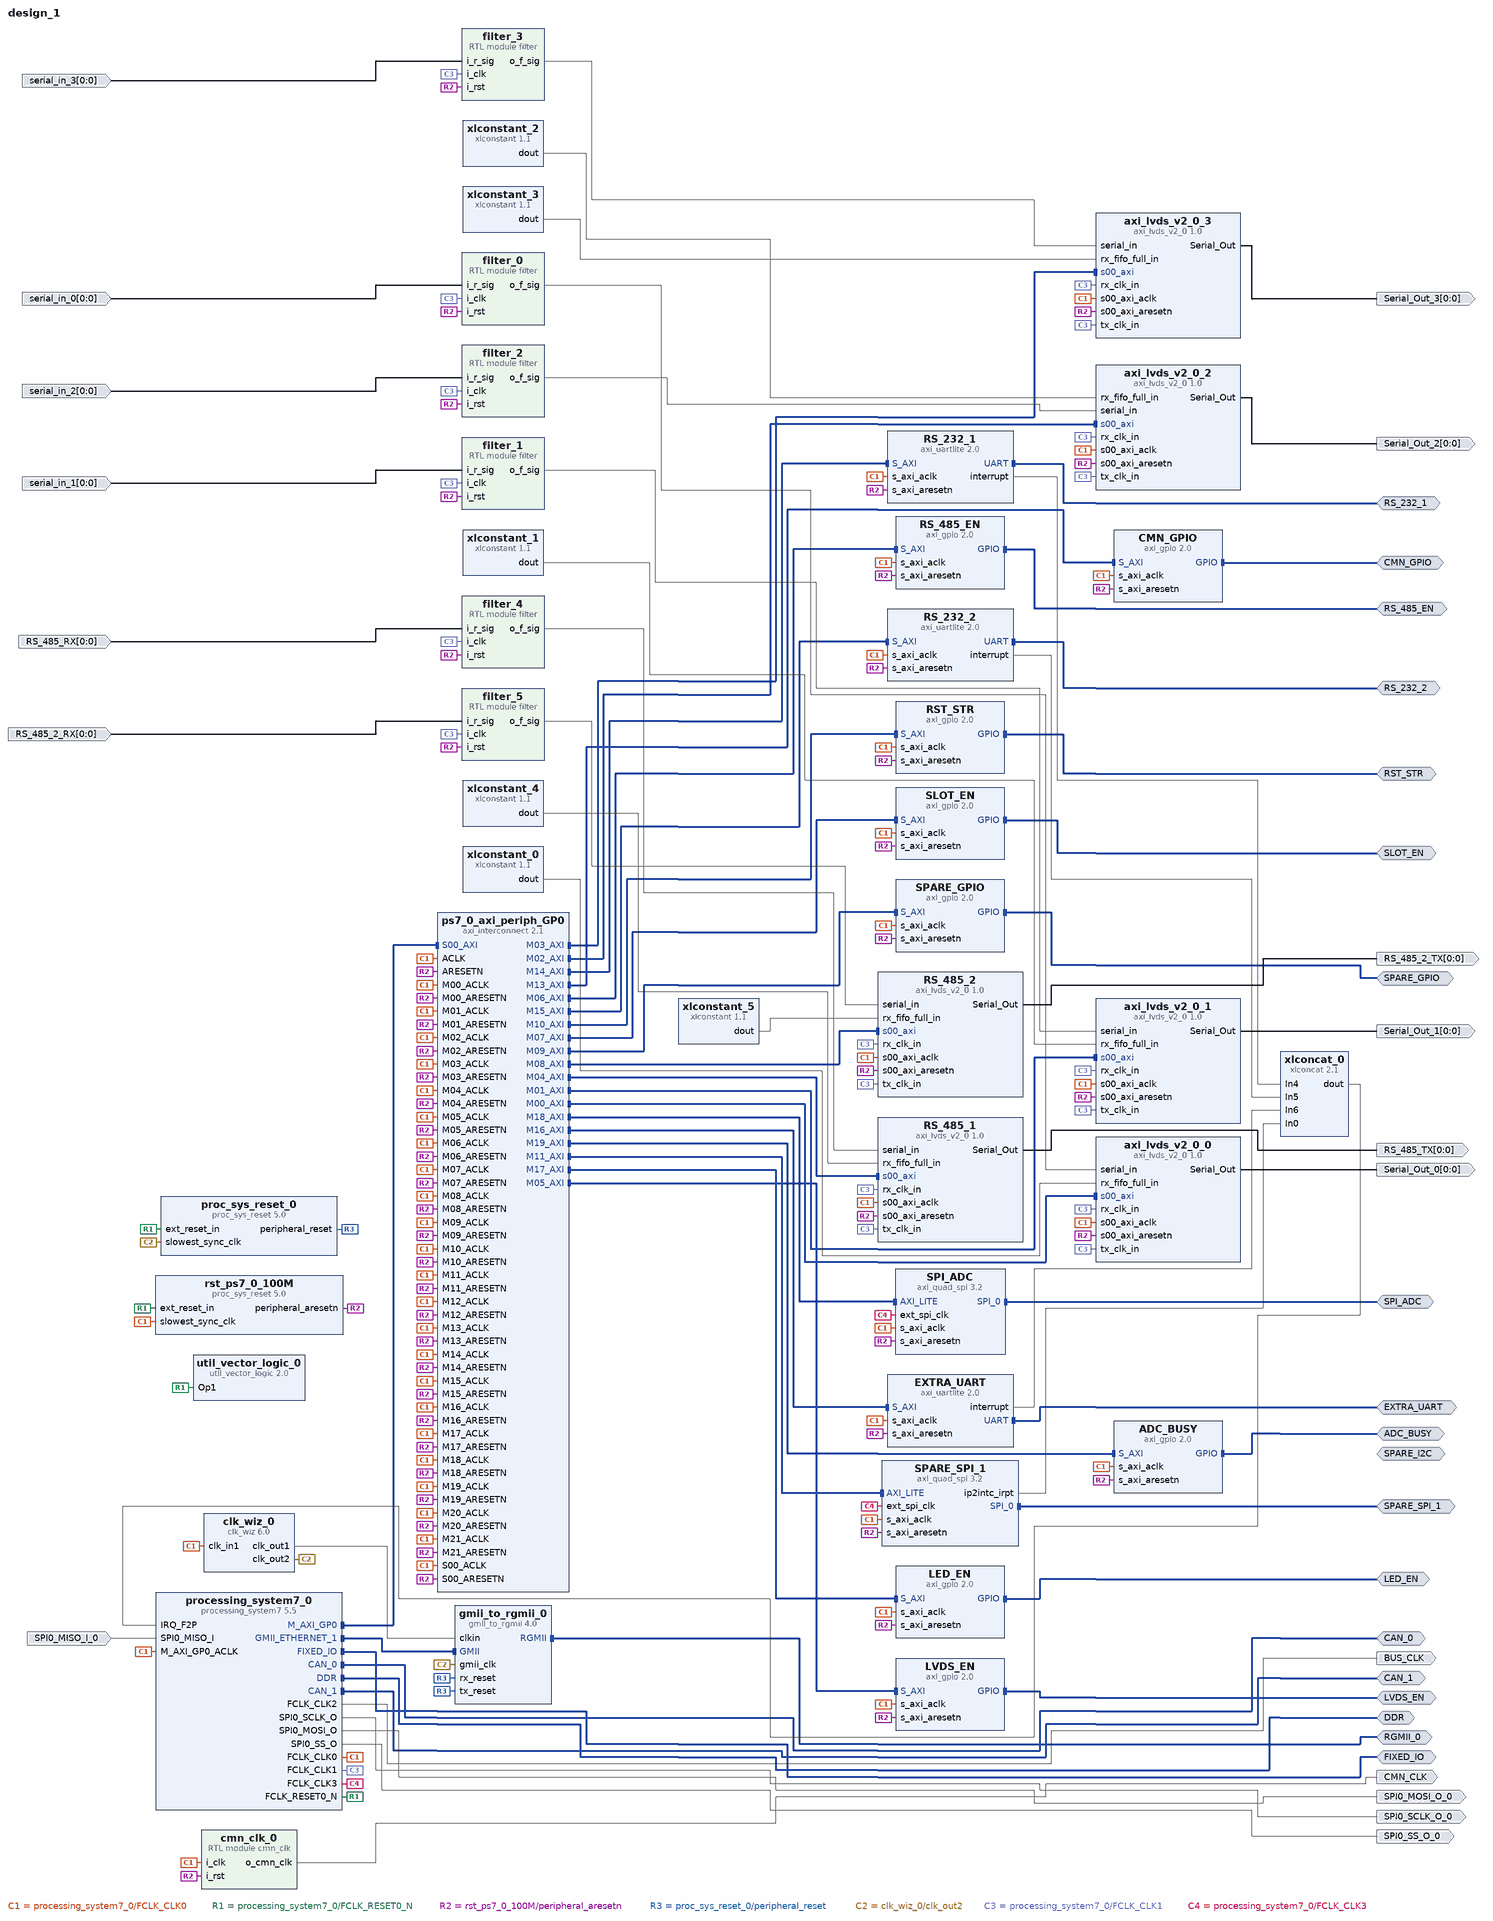
[diagram p0: block diagram of the top level]
# Vivado block design design_1, xc7z020clg400-2, Vivado 2019.1
create_bd_design design_1

create_bd_intf_port -mode Master -vlnv xilinx.com:interface:ddrx_rtl:1.0 DDR
create_bd_intf_port -mode Master -vlnv xilinx.com:display_processing_system7:fixedio_rtl:1.0 FIXED_IO
create_bd_intf_port -mode Master -vlnv xilinx.com:interface:gpio_rtl:1.0 LVDS_EN
create_bd_intf_port -mode Master -vlnv xilinx.com:interface:gpio_rtl:1.0 RS_485_EN
create_bd_intf_port -mode Master -vlnv xilinx.com:interface:rgmii_rtl:1.0 RGMII_0
create_bd_intf_port -mode Master -vlnv xilinx.com:interface:gpio_rtl:1.0 SLOT_EN
create_bd_intf_port -mode Master -vlnv xilinx.com:interface:gpio_rtl:1.0 SPARE_GPIO
create_bd_intf_port -mode Master -vlnv xilinx.com:interface:gpio_rtl:1.0 RST_STR
create_bd_intf_port -mode Master -vlnv xilinx.com:interface:gpio_rtl:1.0 CMN_GPIO
create_bd_intf_port -mode Master -vlnv xilinx.com:interface:uart_rtl:1.0 RS_232_1
create_bd_intf_port -mode Master -vlnv xilinx.com:interface:uart_rtl:1.0 RS_232_2
create_bd_intf_port -mode Master -vlnv xilinx.com:interface:uart_rtl:1.0 EXTRA_UART
create_bd_intf_port -mode Master -vlnv xilinx.com:interface:gpio_rtl:1.0 LED_EN
create_bd_intf_port -mode Master -vlnv xilinx.com:interface:spi_rtl:1.0 SPI_ADC
create_bd_intf_port -mode Master -vlnv xilinx.com:interface:gpio_rtl:1.0 ADC_BUSY
create_bd_intf_port -mode Master -vlnv xilinx.com:interface:spi_rtl:1.0 SPARE_SPI_1
create_bd_intf_port -mode Master -vlnv xilinx.com:interface:can_rtl:1.0 CAN_0
create_bd_intf_port -mode Master -vlnv xilinx.com:interface:can_rtl:1.0 CAN_1
create_bd_intf_port -mode Master -vlnv xilinx.com:interface:iic_rtl:1.0 SPARE_I2C
create_bd_port -dir O -from 0 -to 0 Serial_Out_0
create_bd_port -dir O -from 0 -to 0 Serial_Out_1
create_bd_port -dir I -from 0 -to 0 serial_in_1
create_bd_port -dir O -from 0 -to 0 Serial_Out_2
create_bd_port -dir I -from 0 -to 0 serial_in_2
create_bd_port -dir O -from 0 -to 0 Serial_Out_3
create_bd_port -dir I -from 0 -to 0 serial_in_3
create_bd_port -dir I -from 0 -to 0 serial_in_0
create_bd_port -dir O -type clk BUS_CLK
create_bd_port -dir O -type clk CMN_CLK
create_bd_port -dir I -from 0 -to 0 RS_485_RX
create_bd_port -dir O -from 0 -to 0 RS_485_TX
create_bd_port -dir O -from 0 -to 0 RS_485_2_TX
create_bd_port -dir I -from 0 -to 0 RS_485_2_RX
create_bd_port -dir O SPI0_SCLK_O_0
create_bd_port -dir O SPI0_MOSI_O_0
create_bd_port -dir I SPI0_MISO_I_0
create_bd_port -dir O SPI0_SS_O_0

create_bd_cell -type ip -vlnv xilinx.com:ip:axi_gpio:2.0 LVDS_EN
set_property -dict [list \
  CONFIG.C_ALL_INPUTS 0 \
  CONFIG.C_ALL_OUTPUTS 1 \
  CONFIG.C_DOUT_DEFAULT 0xFFFFFFFF \
  CONFIG.C_GPIO_WIDTH 9 \
  CONFIG.GPIO_BOARD_INTERFACE Custom \
  CONFIG.USE_BOARD_FLOW true \
] [get_bd_cells LVDS_EN]
create_bd_cell -type ip -vlnv xilinx.com:ip:axi_gpio:2.0 RS_485_EN
set_property -dict [list \
  CONFIG.C_ALL_INPUTS 0 \
  CONFIG.C_ALL_OUTPUTS 1 \
  CONFIG.C_GPIO_WIDTH 2 \
  CONFIG.GPIO_BOARD_INTERFACE Custom \
  CONFIG.USE_BOARD_FLOW true \
] [get_bd_cells RS_485_EN]
create_bd_cell -type ip -vlnv xilinx.com:ip:clk_wiz:6.0 clk_wiz_0
set_property -dict [list \
  CONFIG.CLKOUT1_JITTER 114.829 \
  CONFIG.CLKOUT1_REQUESTED_OUT_FREQ 200 \
  CONFIG.CLKOUT2_JITTER 175.402 \
  CONFIG.CLKOUT2_PHASE_ERROR 98.575 \
  CONFIG.CLKOUT2_REQUESTED_OUT_FREQ 25 \
  CONFIG.CLKOUT2_USED true \
  CONFIG.MMCM_CLKOUT0_DIVIDE_F 5.000 \
  CONFIG.MMCM_CLKOUT1_DIVIDE 40 \
  CONFIG.NUM_OUT_CLKS 2 \
  CONFIG.USE_LOCKED false \
  CONFIG.USE_RESET false \
] [get_bd_cells clk_wiz_0]
create_bd_cell -type ip -vlnv xilinx.com:ip:gmii_to_rgmii:4.0 gmii_to_rgmii_0
set_property -dict {CONFIG.C_EXTERNAL_CLOCK true CONFIG.SupportLevel Include_Shared_Logic_in_Core} [get_bd_cells gmii_to_rgmii_0]
create_bd_cell -type ip -vlnv xilinx.com:ip:processing_system7:5.5 processing_system7_0
set_property -dict [list \
  CONFIG.PCW_APU_PERIPHERAL_FREQMHZ 667 \
  CONFIG.PCW_CAN0_CAN0_IO EMIO \
  CONFIG.PCW_CAN0_PERIPHERAL_ENABLE 1 \
  CONFIG.PCW_CAN1_CAN1_IO EMIO \
  CONFIG.PCW_CAN1_PERIPHERAL_ENABLE 1 \
  CONFIG.PCW_CPU_CPU_6X4X_MAX_RANGE 767 \
  CONFIG.PCW_ENET0_ENET0_IO {MIO 16 .. 27} \
  CONFIG.PCW_ENET0_GRP_MDIO_ENABLE 1 \
  CONFIG.PCW_ENET0_GRP_MDIO_IO {MIO 52 .. 53} \
  CONFIG.PCW_ENET0_PERIPHERAL_ENABLE 1 \
  CONFIG.PCW_ENET0_RESET_ENABLE 0 \
  CONFIG.PCW_ENET1_ENET1_IO EMIO \
  CONFIG.PCW_ENET1_PERIPHERAL_ENABLE 1 \
  CONFIG.PCW_ENET_RESET_ENABLE 1 \
  CONFIG.PCW_ENET_RESET_SELECT {Share reset pin} \
  CONFIG.PCW_EN_CLK1_PORT 1 \
  CONFIG.PCW_EN_CLK2_PORT 1 \
  CONFIG.PCW_EN_CLK3_PORT 1 \
  CONFIG.PCW_FCLK_CLK1_BUF TRUE \
  CONFIG.PCW_FCLK_CLK2_BUF TRUE \
  CONFIG.PCW_FCLK_CLK3_BUF TRUE \
  CONFIG.PCW_FPGA0_PERIPHERAL_FREQMHZ 100 \
  CONFIG.PCW_FPGA1_PERIPHERAL_FREQMHZ 200 \
  CONFIG.PCW_FPGA2_PERIPHERAL_FREQMHZ 5 \
  CONFIG.PCW_FPGA3_PERIPHERAL_FREQMHZ 20 \
  CONFIG.PCW_FPGA_FCLK1_ENABLE 1 \
  CONFIG.PCW_FPGA_FCLK2_ENABLE 1 \
  CONFIG.PCW_FPGA_FCLK3_ENABLE 1 \
  CONFIG.PCW_GPIO_MIO_GPIO_ENABLE 1 \
  CONFIG.PCW_GPIO_MIO_GPIO_IO MIO \
  CONFIG.PCW_I2C0_GRP_INT_ENABLE 1 \
  CONFIG.PCW_I2C0_GRP_INT_IO EMIO \
  CONFIG.PCW_I2C0_I2C0_IO {MIO 50 .. 51} \
  CONFIG.PCW_I2C0_PERIPHERAL_ENABLE 1 \
  CONFIG.PCW_I2C1_I2C1_IO {MIO 48 .. 49} \
  CONFIG.PCW_I2C1_PERIPHERAL_ENABLE 1 \
  CONFIG.PCW_I2C_PERIPHERAL_FREQMHZ 111.111115 \
  CONFIG.PCW_I2C_RESET_ENABLE 1 \
  CONFIG.PCW_I2C_RESET_SELECT {Share reset pin} \
  CONFIG.PCW_IRQ_F2P_INTR 1 \
  CONFIG.PCW_PERIPHERAL_BOARD_PRESET part0 \
  CONFIG.PCW_PRESET_BANK1_VOLTAGE {LVCMOS 1.8V} \
  CONFIG.PCW_QSPI_GRP_SINGLE_SS_ENABLE 1 \
  CONFIG.PCW_QSPI_GRP_SINGLE_SS_IO {MIO 1 .. 6} \
  CONFIG.PCW_QSPI_PERIPHERAL_ENABLE 1 \
  CONFIG.PCW_QSPI_QSPI_IO {MIO 1 .. 6} \
  CONFIG.PCW_SD0_GRP_CD_ENABLE 1 \
  CONFIG.PCW_SD0_GRP_CD_IO {MIO 46} \
  CONFIG.PCW_SD0_GRP_WP_ENABLE 0 \
  CONFIG.PCW_SD0_PERIPHERAL_ENABLE 1 \
  CONFIG.PCW_SD0_SD0_IO {MIO 40 .. 45} \
  CONFIG.PCW_SD1_PERIPHERAL_ENABLE 1 \
  CONFIG.PCW_SD1_SD1_IO {MIO 10 .. 15} \
  CONFIG.PCW_SDIO_PERIPHERAL_FREQMHZ 15 \
  CONFIG.PCW_SINGLE_QSPI_DATA_MODE x4 \
  CONFIG.PCW_SPI0_PERIPHERAL_ENABLE 1 \
  CONFIG.PCW_SPI0_SPI0_IO EMIO \
  CONFIG.PCW_UART0_GRP_FULL_ENABLE 1 \
  CONFIG.PCW_UART0_GRP_FULL_IO EMIO \
  CONFIG.PCW_UART0_PERIPHERAL_ENABLE 1 \
  CONFIG.PCW_UART0_UART0_IO EMIO \
  CONFIG.PCW_UART1_PERIPHERAL_ENABLE 1 \
  CONFIG.PCW_UART1_UART1_IO {MIO 8 .. 9} \
  CONFIG.PCW_UART_PERIPHERAL_FREQMHZ 100 \
  CONFIG.PCW_UIPARAM_DDR_FREQ_MHZ 400 \
  CONFIG.PCW_UIPARAM_DDR_PARTNO Custom \
  CONFIG.PCW_USB0_PERIPHERAL_ENABLE 1 \
  CONFIG.PCW_USB0_RESET_ENABLE 1 \
  CONFIG.PCW_USB0_RESET_IO {MIO 7} \
  CONFIG.PCW_USB0_USB0_IO {MIO 28 .. 39} \
  CONFIG.PCW_USB_RESET_ENABLE 1 \
  CONFIG.PCW_USB_RESET_SELECT {Share reset pin} \
  CONFIG.PCW_USE_FABRIC_INTERRUPT 1 \
  CONFIG.PCW_WDT_PERIPHERAL_ENABLE 1 \
  CONFIG.PCW_WDT_WDT_IO EMIO \
] [get_bd_cells processing_system7_0]
# 548 more settings of processing_system7_0 are not shown: defaults, MIO pin electricals, DDR timing, and values the tool derives
create_bd_cell -type ip -vlnv xilinx.com:ip:axi_interconnect:2.1 ps7_0_axi_periph_GP0
set_property -dict {CONFIG.NUM_MI 22} [get_bd_cells ps7_0_axi_periph_GP0]
create_bd_cell -type ip -vlnv xilinx.com:ip:proc_sys_reset:5.0 rst_ps7_0_100M
create_bd_cell -type ip -vlnv xilinx.com:ip:util_vector_logic:2.0 util_vector_logic_0
set_property -dict {CONFIG.C_OPERATION not CONFIG.C_SIZE 1} [get_bd_cells util_vector_logic_0]
create_bd_cell -type ip -vlnv xilinx.com:ip:xlconcat:2.1 xlconcat_0
set_property -dict {CONFIG.NUM_PORTS 7 CONFIG.dout_width 7} [get_bd_cells xlconcat_0]
create_bd_cell -type ip -vlnv xilinx.com:ip:xlconstant:1.1 xlconstant_0
set_property -dict {CONFIG.CONST_VAL 0} [get_bd_cells xlconstant_0]
create_bd_cell -type ip -vlnv xilinx.com:ip:xlconstant:1.1 xlconstant_1
set_property -dict {CONFIG.CONST_VAL 0} [get_bd_cells xlconstant_1]
create_bd_cell -type ip -vlnv xilinx.com:ip:xlconstant:1.1 xlconstant_2
set_property -dict {CONFIG.CONST_VAL 0} [get_bd_cells xlconstant_2]
create_bd_cell -type ip -vlnv xilinx.com:ip:xlconstant:1.1 xlconstant_3
set_property -dict {CONFIG.CONST_VAL 0} [get_bd_cells xlconstant_3]
create_bd_cell -type ip -vlnv xilinx.com:ip:axi_gpio:2.0 SLOT_EN
set_property -dict {CONFIG.C_ALL_OUTPUTS 1 CONFIG.C_GPIO_WIDTH 7} [get_bd_cells SLOT_EN]
create_bd_cell -type ip -vlnv xilinx.com:ip:axi_gpio:2.0 SPARE_GPIO
set_property -dict {CONFIG.C_ALL_OUTPUTS 1 CONFIG.C_GPIO_WIDTH 14} [get_bd_cells SPARE_GPIO]
create_bd_cell -type ip -vlnv xilinx.com:ip:axi_gpio:2.0 RST_STR
set_property -dict {CONFIG.C_ALL_OUTPUTS 1 CONFIG.C_GPIO_WIDTH 2} [get_bd_cells RST_STR]
create_bd_cell -type ip -vlnv xilinx.com:ip:axi_gpio:2.0 CMN_GPIO
set_property -dict {CONFIG.C_ALL_OUTPUTS 1 CONFIG.C_GPIO_WIDTH 13} [get_bd_cells CMN_GPIO]
create_bd_cell -type ip -vlnv xilinx.com:ip:axi_uartlite:2.0 RS_232_1
set_property -dict {CONFIG.C_BAUDRATE 115200} [get_bd_cells RS_232_1]
create_bd_cell -type ip -vlnv xilinx.com:ip:axi_uartlite:2.0 RS_232_2
set_property -dict {CONFIG.C_BAUDRATE 115200} [get_bd_cells RS_232_2]
create_bd_cell -type ip -vlnv xilinx.com:ip:axi_uartlite:2.0 EXTRA_UART
set_property -dict {CONFIG.C_BAUDRATE 115200} [get_bd_cells EXTRA_UART]
create_bd_cell -type ip -vlnv xilinx.com:ip:axi_gpio:2.0 LED_EN
set_property -dict {CONFIG.C_ALL_OUTPUTS 1 CONFIG.C_GPIO_WIDTH 2} [get_bd_cells LED_EN]
create_bd_cell -type ip -vlnv xilinx.com:ip:axi_quad_spi:3.2 SPI_ADC
set_property -dict {CONFIG.C_USE_STARTUP 0} [get_bd_cells SPI_ADC]
create_bd_cell -type ip -vlnv xilinx.com:ip:axi_gpio:2.0 ADC_BUSY
set_property -dict {CONFIG.C_ALL_INPUTS 1 CONFIG.C_GPIO_WIDTH 1} [get_bd_cells ADC_BUSY]
create_bd_cell -type module -reference filter filter_0
create_bd_cell -type module -reference filter filter_1
create_bd_cell -type module -reference filter filter_2
create_bd_cell -type module -reference filter filter_3
create_bd_cell -type ip -vlnv xilinx.com:ip:xlconstant:1.1 xlconstant_4
set_property -dict {CONFIG.CONST_VAL 0} [get_bd_cells xlconstant_4]
create_bd_cell -type module -reference filter filter_4
create_bd_cell -type ip -vlnv xilinx.com:ip:xlconstant:1.1 xlconstant_5
set_property -dict {CONFIG.CONST_VAL 0} [get_bd_cells xlconstant_5]
create_bd_cell -type module -reference filter filter_5
create_bd_cell -type ip -vlnv xilinx.com:user:axi_lvds_v2_0:1.0 RS_485_2
set_property -dict {CONFIG.C_NO_OF_RX 1 CONFIG.C_NO_OF_TX 1} [get_bd_cells RS_485_2]
create_bd_cell -type ip -vlnv xilinx.com:user:axi_lvds_v2_0:1.0 axi_lvds_v2_0_0
set_property -dict {CONFIG.C_NO_OF_RX 1 CONFIG.C_NO_OF_TX 1} [get_bd_cells axi_lvds_v2_0_0]
create_bd_cell -type ip -vlnv xilinx.com:user:axi_lvds_v2_0:1.0 axi_lvds_v2_0_1
set_property -dict {CONFIG.C_NO_OF_RX 1 CONFIG.C_NO_OF_TX 1} [get_bd_cells axi_lvds_v2_0_1]
create_bd_cell -type ip -vlnv xilinx.com:user:axi_lvds_v2_0:1.0 axi_lvds_v2_0_2
set_property -dict {CONFIG.C_NO_OF_RX 1 CONFIG.C_NO_OF_TX 1} [get_bd_cells axi_lvds_v2_0_2]
create_bd_cell -type ip -vlnv xilinx.com:user:axi_lvds_v2_0:1.0 axi_lvds_v2_0_3
set_property -dict {CONFIG.C_NO_OF_RX 1 CONFIG.C_NO_OF_TX 1} [get_bd_cells axi_lvds_v2_0_3]
create_bd_cell -type ip -vlnv xilinx.com:user:axi_lvds_v2_0:1.0 RS_485_1
set_property -dict {CONFIG.C_NO_OF_RX 1 CONFIG.C_NO_OF_TX 1} [get_bd_cells RS_485_1]
create_bd_cell -type ip -vlnv xilinx.com:ip:proc_sys_reset:5.0 proc_sys_reset_0
create_bd_cell -type module -reference cmn_clk cmn_clk_0
create_bd_cell -type ip -vlnv xilinx.com:ip:axi_quad_spi:3.2 SPARE_SPI_1
set_property -dict {CONFIG.C_SCK_RATIO 4 CONFIG.C_USE_STARTUP 0} [get_bd_cells SPARE_SPI_1]

# ---- connections ----

connect_bd_intf_net -intf_net axi_quad_spi_0_SPI_0 [get_bd_intf_ports SPI_ADC] [get_bd_intf_pins SPI_ADC/SPI_0]
connect_bd_intf_net [get_bd_intf_pins ps7_0_axi_periph_GP0/M08_AXI] [get_bd_intf_pins RS_485_2/s00_axi]
connect_bd_intf_net [get_bd_intf_pins ps7_0_axi_periph_GP0/M18_AXI] [get_bd_intf_pins SPI_ADC/AXI_LITE]
connect_bd_intf_net -intf_net axi_uartlite_1_UART [get_bd_intf_ports RS_232_1] [get_bd_intf_pins RS_232_1/UART]
connect_bd_intf_net -intf_net axi_gpio_0_GPIO5 [get_bd_intf_ports LED_EN] [get_bd_intf_pins LED_EN/GPIO]
connect_bd_intf_net [get_bd_intf_ports EXTRA_UART] [get_bd_intf_pins EXTRA_UART/UART]
connect_bd_intf_net [get_bd_intf_pins ps7_0_axi_periph_GP0/M19_AXI] [get_bd_intf_pins ADC_BUSY/S_AXI]
connect_bd_intf_net -intf_net axi_gpio_0_GPIO6 [get_bd_intf_ports ADC_BUSY] [get_bd_intf_pins ADC_BUSY/GPIO]
connect_bd_intf_net [get_bd_intf_pins ps7_0_axi_periph_GP0/M17_AXI] [get_bd_intf_pins LED_EN/S_AXI]
connect_bd_intf_net -intf_net axi_gpio_0_GPIO2 [get_bd_intf_ports SPARE_GPIO] [get_bd_intf_pins SPARE_GPIO/GPIO]
connect_bd_intf_net [get_bd_intf_pins ps7_0_axi_periph_GP0/M13_AXI] [get_bd_intf_pins CMN_GPIO/S_AXI]
connect_bd_intf_net [get_bd_intf_pins ps7_0_axi_periph_GP0/M14_AXI] [get_bd_intf_pins RS_232_1/S_AXI]
connect_bd_intf_net [get_bd_intf_ports RS_232_2] [get_bd_intf_pins RS_232_2/UART]
connect_bd_intf_net -intf_net axi_gpio_0_GPIO4 [get_bd_intf_ports CMN_GPIO] [get_bd_intf_pins CMN_GPIO/GPIO]
connect_bd_intf_net [get_bd_intf_pins ps7_0_axi_periph_GP0/M04_AXI] [get_bd_intf_pins RS_485_1/s00_axi]
connect_bd_intf_net [get_bd_intf_pins ps7_0_axi_periph_GP0/M01_AXI] [get_bd_intf_pins axi_lvds_v2_0_1/s00_axi]
connect_bd_intf_net [get_bd_intf_ports RGMII_0] [get_bd_intf_pins gmii_to_rgmii_0/RGMII]
connect_bd_intf_net [get_bd_intf_pins ps7_0_axi_periph_GP0/M15_AXI] [get_bd_intf_pins RS_232_2/S_AXI]
connect_bd_intf_net [get_bd_intf_pins ps7_0_axi_periph_GP0/M07_AXI] [get_bd_intf_pins SLOT_EN/S_AXI]
connect_bd_intf_net -intf_net axi_gpio_0_GPIO1 [get_bd_intf_ports SLOT_EN] [get_bd_intf_pins SLOT_EN/GPIO]
connect_bd_intf_net -intf_net axi_gpio_1_GPIO [get_bd_intf_ports RS_485_EN] [get_bd_intf_pins RS_485_EN/GPIO]
connect_bd_intf_net [get_bd_intf_pins ps7_0_axi_periph_GP0/M03_AXI] [get_bd_intf_pins axi_lvds_v2_0_3/s00_axi]
connect_bd_intf_net [get_bd_intf_pins processing_system7_0/GMII_ETHERNET_1] [get_bd_intf_pins gmii_to_rgmii_0/GMII]
connect_bd_intf_net [get_bd_intf_pins ps7_0_axi_periph_GP0/M09_AXI] [get_bd_intf_pins SPARE_GPIO/S_AXI]
connect_bd_intf_net [get_bd_intf_pins ps7_0_axi_periph_GP0/M10_AXI] [get_bd_intf_pins RST_STR/S_AXI]
connect_bd_intf_net -intf_net axi_gpio_0_GPIO3 [get_bd_intf_ports RST_STR] [get_bd_intf_pins RST_STR/GPIO]
connect_bd_intf_net [get_bd_intf_pins ps7_0_axi_periph_GP0/M16_AXI] [get_bd_intf_pins EXTRA_UART/S_AXI]
connect_bd_intf_net -intf_net axi_gpio_0_GPIO [get_bd_intf_ports LVDS_EN] [get_bd_intf_pins LVDS_EN/GPIO]
connect_bd_intf_net [get_bd_intf_pins processing_system7_0/M_AXI_GP0] [get_bd_intf_pins ps7_0_axi_periph_GP0/S00_AXI]
connect_bd_intf_net [get_bd_intf_ports FIXED_IO] [get_bd_intf_pins processing_system7_0/FIXED_IO]
connect_bd_intf_net [get_bd_intf_pins ps7_0_axi_periph_GP0/M06_AXI] [get_bd_intf_pins RS_485_EN/S_AXI]
connect_bd_intf_net [get_bd_intf_pins ps7_0_axi_periph_GP0/M02_AXI] [get_bd_intf_pins axi_lvds_v2_0_2/s00_axi]
connect_bd_intf_net [get_bd_intf_pins ps7_0_axi_periph_GP0/M05_AXI] [get_bd_intf_pins LVDS_EN/S_AXI]
connect_bd_intf_net [get_bd_intf_ports DDR] [get_bd_intf_pins processing_system7_0/DDR]
connect_bd_intf_net [get_bd_intf_ports CAN_0] [get_bd_intf_pins processing_system7_0/CAN_0]
connect_bd_intf_net [get_bd_intf_ports CAN_1] [get_bd_intf_pins processing_system7_0/CAN_1]
connect_bd_intf_net [get_bd_intf_pins ps7_0_axi_periph_GP0/M00_AXI] [get_bd_intf_pins axi_lvds_v2_0_0/s00_axi]
connect_bd_intf_net -intf_net axi_quad_spi_0_SPI_1 [get_bd_intf_ports SPARE_SPI_1] [get_bd_intf_pins SPARE_SPI_1/SPI_0]
connect_bd_intf_net [get_bd_intf_pins ps7_0_axi_periph_GP0/M11_AXI] [get_bd_intf_pins SPARE_SPI_1/AXI_LITE]
connect_bd_net [get_bd_pins processing_system7_0/FCLK_CLK0] \
  [get_bd_pins LVDS_EN/s_axi_aclk] [get_bd_pins RS_485_EN/s_axi_aclk] [get_bd_pins clk_wiz_0/clk_in1] \
  [get_bd_pins processing_system7_0/M_AXI_GP0_ACLK] [get_bd_pins ps7_0_axi_periph_GP0/ACLK] \
  [get_bd_pins ps7_0_axi_periph_GP0/S00_ACLK] [get_bd_pins ps7_0_axi_periph_GP0/M00_ACLK] \
  [get_bd_pins ps7_0_axi_periph_GP0/M01_ACLK] [get_bd_pins ps7_0_axi_periph_GP0/M02_ACLK] \
  [get_bd_pins ps7_0_axi_periph_GP0/M03_ACLK] [get_bd_pins ps7_0_axi_periph_GP0/M04_ACLK] \
  [get_bd_pins ps7_0_axi_periph_GP0/M05_ACLK] [get_bd_pins ps7_0_axi_periph_GP0/M06_ACLK] \
  [get_bd_pins ps7_0_axi_periph_GP0/M07_ACLK] [get_bd_pins ps7_0_axi_periph_GP0/M08_ACLK] \
  [get_bd_pins ps7_0_axi_periph_GP0/M09_ACLK] [get_bd_pins ps7_0_axi_periph_GP0/M10_ACLK] \
  [get_bd_pins ps7_0_axi_periph_GP0/M11_ACLK] [get_bd_pins ps7_0_axi_periph_GP0/M12_ACLK] \
  [get_bd_pins ps7_0_axi_periph_GP0/M13_ACLK] [get_bd_pins ps7_0_axi_periph_GP0/M14_ACLK] \
  [get_bd_pins ps7_0_axi_periph_GP0/M15_ACLK] [get_bd_pins ps7_0_axi_periph_GP0/M16_ACLK] \
  [get_bd_pins ps7_0_axi_periph_GP0/M17_ACLK] [get_bd_pins ps7_0_axi_periph_GP0/M18_ACLK] \
  [get_bd_pins ps7_0_axi_periph_GP0/M19_ACLK] [get_bd_pins ps7_0_axi_periph_GP0/M20_ACLK] \
  [get_bd_pins ps7_0_axi_periph_GP0/M21_ACLK] [get_bd_pins rst_ps7_0_100M/slowest_sync_clk] [get_bd_pins SLOT_EN/s_axi_aclk] \
  [get_bd_pins SPARE_GPIO/s_axi_aclk] [get_bd_pins RST_STR/s_axi_aclk] [get_bd_pins CMN_GPIO/s_axi_aclk] \
  [get_bd_pins RS_232_1/s_axi_aclk] [get_bd_pins RS_232_2/s_axi_aclk] [get_bd_pins EXTRA_UART/s_axi_aclk] \
  [get_bd_pins LED_EN/s_axi_aclk] [get_bd_pins SPI_ADC/s_axi_aclk] [get_bd_pins ADC_BUSY/s_axi_aclk] \
  [get_bd_pins RS_485_2/s00_axi_aclk] [get_bd_pins axi_lvds_v2_0_0/s00_axi_aclk] [get_bd_pins axi_lvds_v2_0_1/s00_axi_aclk] \
  [get_bd_pins axi_lvds_v2_0_2/s00_axi_aclk] [get_bd_pins axi_lvds_v2_0_3/s00_axi_aclk] [get_bd_pins RS_485_1/s00_axi_aclk] \
  [get_bd_pins cmn_clk_0/i_clk] [get_bd_pins SPARE_SPI_1/s_axi_aclk]
connect_bd_net [get_bd_pins processing_system7_0/FCLK_RESET0_N] \
  [get_bd_pins rst_ps7_0_100M/ext_reset_in] [get_bd_pins util_vector_logic_0/Op1] [get_bd_pins proc_sys_reset_0/ext_reset_in]
connect_bd_net [get_bd_pins rst_ps7_0_100M/peripheral_aresetn] \
  [get_bd_pins LVDS_EN/s_axi_aresetn] [get_bd_pins RS_485_EN/s_axi_aresetn] [get_bd_pins ps7_0_axi_periph_GP0/S00_ARESETN] \
  [get_bd_pins ps7_0_axi_periph_GP0/M00_ARESETN] [get_bd_pins ps7_0_axi_periph_GP0/M01_ARESETN] \
  [get_bd_pins ps7_0_axi_periph_GP0/M02_ARESETN] [get_bd_pins ps7_0_axi_periph_GP0/M03_ARESETN] \
  [get_bd_pins ps7_0_axi_periph_GP0/M04_ARESETN] [get_bd_pins ps7_0_axi_periph_GP0/M05_ARESETN] \
  [get_bd_pins ps7_0_axi_periph_GP0/M06_ARESETN] [get_bd_pins ps7_0_axi_periph_GP0/M07_ARESETN] \
  [get_bd_pins ps7_0_axi_periph_GP0/M08_ARESETN] [get_bd_pins ps7_0_axi_periph_GP0/M09_ARESETN] \
  [get_bd_pins ps7_0_axi_periph_GP0/M10_ARESETN] [get_bd_pins ps7_0_axi_periph_GP0/M11_ARESETN] \
  [get_bd_pins ps7_0_axi_periph_GP0/M12_ARESETN] [get_bd_pins ps7_0_axi_periph_GP0/M13_ARESETN] \
  [get_bd_pins ps7_0_axi_periph_GP0/M14_ARESETN] [get_bd_pins ps7_0_axi_periph_GP0/M15_ARESETN] \
  [get_bd_pins ps7_0_axi_periph_GP0/M16_ARESETN] [get_bd_pins ps7_0_axi_periph_GP0/M17_ARESETN] \
  [get_bd_pins ps7_0_axi_periph_GP0/M18_ARESETN] [get_bd_pins ps7_0_axi_periph_GP0/M19_ARESETN] \
  [get_bd_pins ps7_0_axi_periph_GP0/M20_ARESETN] [get_bd_pins ps7_0_axi_periph_GP0/M21_ARESETN] \
  [get_bd_pins ps7_0_axi_periph_GP0/ARESETN] [get_bd_pins SLOT_EN/s_axi_aresetn] [get_bd_pins SPARE_GPIO/s_axi_aresetn] \
  [get_bd_pins RST_STR/s_axi_aresetn] [get_bd_pins CMN_GPIO/s_axi_aresetn] [get_bd_pins RS_232_1/s_axi_aresetn] \
  [get_bd_pins RS_232_2/s_axi_aresetn] [get_bd_pins EXTRA_UART/s_axi_aresetn] [get_bd_pins LED_EN/s_axi_aresetn] \
  [get_bd_pins SPI_ADC/s_axi_aresetn] [get_bd_pins ADC_BUSY/s_axi_aresetn] [get_bd_pins filter_0/i_rst] \
  [get_bd_pins filter_1/i_rst] [get_bd_pins filter_2/i_rst] [get_bd_pins filter_3/i_rst] [get_bd_pins filter_4/i_rst] \
  [get_bd_pins filter_5/i_rst] [get_bd_pins RS_485_2/s00_axi_aresetn] [get_bd_pins axi_lvds_v2_0_0/s00_axi_aresetn] \
  [get_bd_pins axi_lvds_v2_0_1/s00_axi_aresetn] [get_bd_pins axi_lvds_v2_0_2/s00_axi_aresetn] \
  [get_bd_pins axi_lvds_v2_0_3/s00_axi_aresetn] [get_bd_pins RS_485_1/s00_axi_aresetn] [get_bd_pins cmn_clk_0/i_rst] \
  [get_bd_pins SPARE_SPI_1/s_axi_aresetn]
connect_bd_net [get_bd_pins proc_sys_reset_0/peripheral_reset] [get_bd_pins gmii_to_rgmii_0/tx_reset] [get_bd_pins gmii_to_rgmii_0/rx_reset]
connect_bd_net [get_bd_pins clk_wiz_0/clk_out1] [get_bd_pins gmii_to_rgmii_0/clkin]
connect_bd_net [get_bd_pins clk_wiz_0/clk_out2] [get_bd_pins gmii_to_rgmii_0/gmii_clk] [get_bd_pins proc_sys_reset_0/slowest_sync_clk]
connect_bd_net [get_bd_pins processing_system7_0/FCLK_CLK1] \
  [get_bd_pins filter_0/i_clk] [get_bd_pins filter_1/i_clk] [get_bd_pins filter_2/i_clk] [get_bd_pins filter_3/i_clk] \
  [get_bd_pins filter_4/i_clk] [get_bd_pins filter_5/i_clk] [get_bd_pins RS_485_2/tx_clk_in] [get_bd_pins RS_485_2/rx_clk_in] \
  [get_bd_pins axi_lvds_v2_0_0/tx_clk_in] [get_bd_pins axi_lvds_v2_0_0/rx_clk_in] [get_bd_pins axi_lvds_v2_0_1/tx_clk_in] \
  [get_bd_pins axi_lvds_v2_0_1/rx_clk_in] [get_bd_pins axi_lvds_v2_0_2/tx_clk_in] [get_bd_pins axi_lvds_v2_0_2/rx_clk_in] \
  [get_bd_pins axi_lvds_v2_0_3/tx_clk_in] [get_bd_pins axi_lvds_v2_0_3/rx_clk_in] [get_bd_pins RS_485_1/tx_clk_in] \
  [get_bd_pins RS_485_1/rx_clk_in]
connect_bd_net [get_bd_pins xlconstant_0/dout] [get_bd_pins axi_lvds_v2_0_0/rx_fifo_full_in]
connect_bd_net [get_bd_pins axi_lvds_v2_0_0/Serial_Out] [get_bd_ports Serial_Out_0]
connect_bd_net [get_bd_pins xlconstant_1/dout] [get_bd_pins axi_lvds_v2_0_1/rx_fifo_full_in]
connect_bd_net [get_bd_pins axi_lvds_v2_0_1/Serial_Out] [get_bd_ports Serial_Out_1]
connect_bd_net [get_bd_pins axi_lvds_v2_0_2/Serial_Out] [get_bd_ports Serial_Out_2]
connect_bd_net [get_bd_pins axi_lvds_v2_0_3/Serial_Out] [get_bd_ports Serial_Out_3]
connect_bd_net [get_bd_pins xlconstant_2/dout] [get_bd_pins axi_lvds_v2_0_2/rx_fifo_full_in]
connect_bd_net [get_bd_pins xlconstant_3/dout] [get_bd_pins axi_lvds_v2_0_3/rx_fifo_full_in]
connect_bd_net [get_bd_pins xlconcat_0/dout] [get_bd_pins processing_system7_0/IRQ_F2P]
connect_bd_net [get_bd_pins RS_232_1/interrupt] [get_bd_pins xlconcat_0/In4]
connect_bd_net [get_bd_pins RS_232_2/interrupt] [get_bd_pins xlconcat_0/In5]
connect_bd_net [get_bd_pins EXTRA_UART/interrupt] [get_bd_pins xlconcat_0/In6]
connect_bd_net [get_bd_pins processing_system7_0/FCLK_CLK2] [get_bd_ports BUS_CLK]
connect_bd_net [get_bd_pins cmn_clk_0/o_cmn_clk] [get_bd_ports CMN_CLK]
connect_bd_net [get_bd_pins processing_system7_0/FCLK_CLK3] [get_bd_pins SPI_ADC/ext_spi_clk] [get_bd_pins SPARE_SPI_1/ext_spi_clk]
connect_bd_net [get_bd_pins filter_0/o_f_sig] [get_bd_pins axi_lvds_v2_0_0/serial_in]
connect_bd_net -net serial_in_0_1 [get_bd_ports serial_in_0] [get_bd_pins filter_0/i_r_sig]
connect_bd_net [get_bd_pins filter_1/o_f_sig] [get_bd_pins axi_lvds_v2_0_1/serial_in]
connect_bd_net -net serial_in_1_1 [get_bd_ports serial_in_1] [get_bd_pins filter_1/i_r_sig]
connect_bd_net [get_bd_pins filter_2/o_f_sig] [get_bd_pins axi_lvds_v2_0_2/serial_in]
connect_bd_net -net serial_in_2_1 [get_bd_ports serial_in_2] [get_bd_pins filter_2/i_r_sig]
connect_bd_net [get_bd_pins filter_3/o_f_sig] [get_bd_pins axi_lvds_v2_0_3/serial_in]
connect_bd_net -net serial_in_3_1 [get_bd_ports serial_in_3] [get_bd_pins filter_3/i_r_sig]
connect_bd_net [get_bd_pins xlconstant_4/dout] [get_bd_pins RS_485_1/rx_fifo_full_in]
connect_bd_net -net serial_in_4_1 [get_bd_ports RS_485_RX] [get_bd_pins filter_4/i_r_sig]
connect_bd_net [get_bd_pins filter_4/o_f_sig] [get_bd_pins RS_485_1/serial_in]
connect_bd_net -net axi_lvds_v2_0_4_Serial_Out [get_bd_pins RS_485_1/Serial_Out] [get_bd_ports RS_485_TX]
connect_bd_net [get_bd_pins RS_485_2/Serial_Out] [get_bd_ports RS_485_2_TX]
connect_bd_net [get_bd_pins xlconstant_5/dout] [get_bd_pins RS_485_2/rx_fifo_full_in]
connect_bd_net [get_bd_ports RS_485_2_RX] [get_bd_pins filter_5/i_r_sig]
connect_bd_net [get_bd_pins filter_5/o_f_sig] [get_bd_pins RS_485_2/serial_in]
connect_bd_net [get_bd_pins processing_system7_0/SPI0_SCLK_O] [get_bd_ports SPI0_SCLK_O_0]
connect_bd_net [get_bd_pins processing_system7_0/SPI0_MOSI_O] [get_bd_ports SPI0_MOSI_O_0]
connect_bd_net -net SPI0_MISO_I_0_1 [get_bd_ports SPI0_MISO_I_0] [get_bd_pins processing_system7_0/SPI0_MISO_I]
connect_bd_net [get_bd_pins processing_system7_0/SPI0_SS_O] [get_bd_ports SPI0_SS_O_0]
connect_bd_net [get_bd_pins SPARE_SPI_1/ip2intc_irpt] [get_bd_pins xlconcat_0/In0]
set_property HDL_ATTRIBUTE.BMM_INFO_PROCESSOR {arm > design_1 axi_bram_ctrl_0 design_1 axi_bram_ctrl_1 design_1 axi_bram_ctrl_2 design_1 axi_bram_ctrl_3} [get_bd_cells processing_system7_0]
set_property HDL_ATTRIBUTE.KEEP_HIERARCHY yes [get_bd_cells processing_system7_0]

# ---- address map ----
assign_bd_address -offset 0x41200000 -range 64K -target_address_space [get_bd_addr_spaces processing_system7_0/Data] [get_bd_addr_segs SLOT_EN/S_AXI/Reg]
assign_bd_address -offset 0x41210000 -range 64K -target_address_space [get_bd_addr_spaces processing_system7_0/Data] [get_bd_addr_segs LVDS_EN/S_AXI/Reg]
assign_bd_address -offset 0x41220000 -range 64K -target_address_space [get_bd_addr_spaces processing_system7_0/Data] [get_bd_addr_segs RS_485_EN/S_AXI/Reg]
assign_bd_address -offset 0x41230000 -range 64K -target_address_space [get_bd_addr_spaces processing_system7_0/Data] [get_bd_addr_segs SPARE_GPIO/S_AXI/Reg]
assign_bd_address -offset 0x41240000 -range 64K -target_address_space [get_bd_addr_spaces processing_system7_0/Data] [get_bd_addr_segs RST_STR/S_AXI/Reg]
assign_bd_address -offset 0x41250000 -range 64K -target_address_space [get_bd_addr_spaces processing_system7_0/Data] [get_bd_addr_segs CMN_GPIO/S_AXI/Reg]
assign_bd_address -offset 0x41260000 -range 64K -target_address_space [get_bd_addr_spaces processing_system7_0/Data] [get_bd_addr_segs LED_EN/S_AXI/Reg]
assign_bd_address -offset 0x41270000 -range 64K -target_address_space [get_bd_addr_spaces processing_system7_0/Data] [get_bd_addr_segs ADC_BUSY/S_AXI/Reg]
assign_bd_address -offset 0x41E00000 -range 64K -target_address_space [get_bd_addr_spaces processing_system7_0/Data] [get_bd_addr_segs SPARE_SPI_1/AXI_LITE/Reg]
assign_bd_address -offset 0x41E20000 -range 64K -target_address_space [get_bd_addr_spaces processing_system7_0/Data] [get_bd_addr_segs SPI_ADC/AXI_LITE/Reg]
assign_bd_address -offset 0x42C20000 -range 64K -target_address_space [get_bd_addr_spaces processing_system7_0/Data] [get_bd_addr_segs RS_232_1/S_AXI/Reg]
assign_bd_address -offset 0x42C30000 -range 64K -target_address_space [get_bd_addr_spaces processing_system7_0/Data] [get_bd_addr_segs RS_232_2/S_AXI/Reg]
assign_bd_address -offset 0x42C40000 -range 64K -target_address_space [get_bd_addr_spaces processing_system7_0/Data] [get_bd_addr_segs EXTRA_UART/S_AXI/Reg]
assign_bd_address -offset 0x43C00000 -range 64K -target_address_space [get_bd_addr_spaces processing_system7_0/Data] [get_bd_addr_segs axi_lvds_v2_0_0/s00_axi/reg0]
assign_bd_address -offset 0x43C10000 -range 64K -target_address_space [get_bd_addr_spaces processing_system7_0/Data] [get_bd_addr_segs axi_lvds_v2_0_1/s00_axi/reg0]
assign_bd_address -offset 0x43C20000 -range 64K -target_address_space [get_bd_addr_spaces processing_system7_0/Data] [get_bd_addr_segs axi_lvds_v2_0_2/s00_axi/reg0]
assign_bd_address -offset 0x43C30000 -range 64K -target_address_space [get_bd_addr_spaces processing_system7_0/Data] [get_bd_addr_segs axi_lvds_v2_0_3/s00_axi/reg0]
assign_bd_address -offset 0x43C40000 -range 64K -target_address_space [get_bd_addr_spaces processing_system7_0/Data] [get_bd_addr_segs RS_485_1/s00_axi/reg0]
assign_bd_address -offset 0x43C50000 -range 64K -target_address_space [get_bd_addr_spaces processing_system7_0/Data] [get_bd_addr_segs RS_485_2/s00_axi/reg0]

validate_bd_design
save_bd_design
